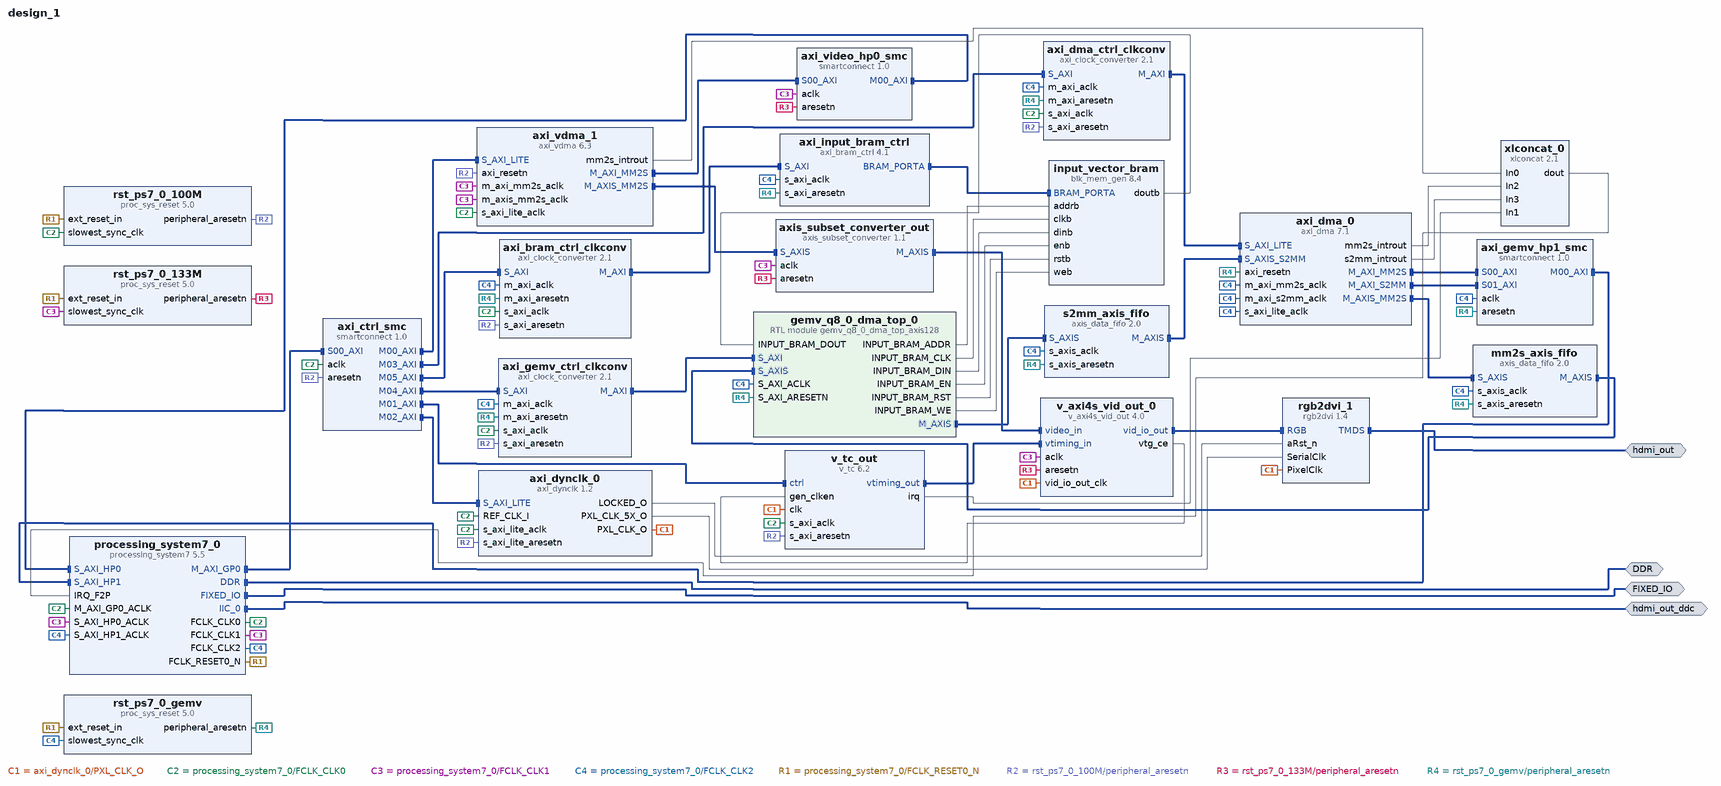
[diagram p0: block diagram of the top level]
# Vivado block design design_1, xc7z020clg400-1, Vivado 2024.2.2
create_bd_design design_1

create_bd_intf_port -mode Master -vlnv xilinx.com:interface:ddrx_rtl:1.0 DDR
create_bd_intf_port -mode Master -vlnv xilinx.com:display_processing_system7:fixedio_rtl:1.0 FIXED_IO
create_bd_intf_port -mode Master -vlnv digilentinc.com:interface:tmds_rtl:1.0 hdmi_out
create_bd_intf_port -mode Master -vlnv xilinx.com:interface:iic_rtl:1.0 hdmi_out_ddc

create_bd_cell -type ip -vlnv xilinx.com:ip:processing_system7:5.5 processing_system7_0
set_property -dict [list \
  CONFIG.PCW_APU_PERIPHERAL_FREQMHZ 666.666666 \
  CONFIG.PCW_ENET0_ENET0_IO {MIO 16 .. 27} \
  CONFIG.PCW_ENET0_GRP_MDIO_ENABLE 1 \
  CONFIG.PCW_ENET0_GRP_MDIO_IO {MIO 52 .. 53} \
  CONFIG.PCW_ENET0_PERIPHERAL_ENABLE 1 \
  CONFIG.PCW_ENET0_RESET_ENABLE 0 \
  CONFIG.PCW_ENET_RESET_ENABLE 1 \
  CONFIG.PCW_ENET_RESET_SELECT {Share reset pin} \
  CONFIG.PCW_EN_CLK1_PORT 1 \
  CONFIG.PCW_EN_CLK2_PORT 1 \
  CONFIG.PCW_FCLK_CLK1_BUF TRUE \
  CONFIG.PCW_FCLK_CLK2_BUF TRUE \
  CONFIG.PCW_FPGA0_PERIPHERAL_FREQMHZ 100.000000 \
  CONFIG.PCW_FPGA1_PERIPHERAL_FREQMHZ 133.333333 \
  CONFIG.PCW_FPGA2_PERIPHERAL_FREQMHZ 74.000000 \
  CONFIG.PCW_FPGA_FCLK1_ENABLE 1 \
  CONFIG.PCW_FPGA_FCLK2_ENABLE 1 \
  CONFIG.PCW_GPIO_MIO_GPIO_ENABLE 1 \
  CONFIG.PCW_GPIO_MIO_GPIO_IO MIO \
  CONFIG.PCW_I2C0_I2C0_IO EMIO \
  CONFIG.PCW_I2C0_PERIPHERAL_ENABLE 1 \
  CONFIG.PCW_I2C_PERIPHERAL_FREQMHZ 111.111115 \
  CONFIG.PCW_I2C_RESET_ENABLE 1 \
  CONFIG.PCW_I2C_RESET_SELECT {Share reset pin} \
  CONFIG.PCW_IRQ_F2P_INTR 1 \
  CONFIG.PCW_PRESET_BANK1_VOLTAGE {LVCMOS 1.8V} \
  CONFIG.PCW_QSPI_GRP_FBCLK_ENABLE 1 \
  CONFIG.PCW_QSPI_GRP_FBCLK_IO {MIO 8} \
  CONFIG.PCW_QSPI_GRP_SINGLE_SS_ENABLE 1 \
  CONFIG.PCW_QSPI_GRP_SINGLE_SS_IO {MIO 1 .. 6} \
  CONFIG.PCW_QSPI_PERIPHERAL_ENABLE 1 \
  CONFIG.PCW_QSPI_QSPI_IO {MIO 1 .. 6} \
  CONFIG.PCW_SD0_GRP_CD_ENABLE 1 \
  CONFIG.PCW_SD0_GRP_CD_IO {MIO 47} \
  CONFIG.PCW_SD0_GRP_WP_ENABLE 0 \
  CONFIG.PCW_SD0_PERIPHERAL_ENABLE 1 \
  CONFIG.PCW_SD0_SD0_IO {MIO 40 .. 45} \
  CONFIG.PCW_SDIO_PERIPHERAL_FREQMHZ 50 \
  CONFIG.PCW_SINGLE_QSPI_DATA_MODE x4 \
  CONFIG.PCW_UART1_PERIPHERAL_ENABLE 1 \
  CONFIG.PCW_UART1_UART1_IO {MIO 48 .. 49} \
  CONFIG.PCW_UART_PERIPHERAL_FREQMHZ 100 \
  CONFIG.PCW_UIPARAM_DDR_FREQ_MHZ 533.333333 \
  CONFIG.PCW_UIPARAM_DDR_MEMORY_TYPE {DDR 3 (Low Voltage)} \
  CONFIG.PCW_UIPARAM_DDR_PARTNO {MT41K256M16 RE-125} \
  CONFIG.PCW_USB0_PERIPHERAL_ENABLE 1 \
  CONFIG.PCW_USB0_RESET_ENABLE 1 \
  CONFIG.PCW_USB0_RESET_IO {MIO 46} \
  CONFIG.PCW_USB0_USB0_IO {MIO 28 .. 39} \
  CONFIG.PCW_USB_RESET_ENABLE 1 \
  CONFIG.PCW_USB_RESET_SELECT {Share reset pin} \
  CONFIG.PCW_USE_FABRIC_INTERRUPT 1 \
  CONFIG.PCW_USE_S_AXI_HP0 1 \
  CONFIG.PCW_USE_S_AXI_HP1 1 \
] [get_bd_cells processing_system7_0]
# 301 more settings of processing_system7_0 are not shown: defaults, MIO pin electricals, DDR timing, and values the tool derives
create_bd_cell -type ip -vlnv xilinx.com:ip:proc_sys_reset:5.0 rst_ps7_0_100M
create_bd_cell -type ip -vlnv xilinx.com:ip:proc_sys_reset:5.0 rst_ps7_0_133M
create_bd_cell -type ip -vlnv xilinx.com:ip:proc_sys_reset:5.0 rst_ps7_0_gemv
create_bd_cell -type ip -vlnv xilinx.com:ip:smartconnect:1.0 axi_ctrl_smc
set_property -dict {CONFIG.NUM_MI 6 CONFIG.NUM_SI 1} [get_bd_cells axi_ctrl_smc]
create_bd_cell -type ip -vlnv xilinx.com:ip:smartconnect:1.0 axi_video_hp0_smc
set_property -dict {CONFIG.NUM_MI 1 CONFIG.NUM_SI 1} [get_bd_cells axi_video_hp0_smc]
create_bd_cell -type ip -vlnv xilinx.com:ip:smartconnect:1.0 axi_gemv_hp1_smc
set_property -dict {CONFIG.NUM_MI 1 CONFIG.NUM_SI 2} [get_bd_cells axi_gemv_hp1_smc]
create_bd_cell -type ip -vlnv xilinx.com:ip:axi_clock_converter:2.1 axi_gemv_ctrl_clkconv
set_property -dict {CONFIG.ADDR_WIDTH 12 CONFIG.DATA_WIDTH 32 CONFIG.PROTOCOL AXI4LITE} [get_bd_cells axi_gemv_ctrl_clkconv]
create_bd_cell -type ip -vlnv xilinx.com:ip:axi_clock_converter:2.1 axi_bram_ctrl_clkconv
set_property -dict {CONFIG.ADDR_WIDTH 16 CONFIG.DATA_WIDTH 32 CONFIG.PROTOCOL AXI4} [get_bd_cells axi_bram_ctrl_clkconv]
create_bd_cell -type ip -vlnv xilinx.com:ip:axi_clock_converter:2.1 axi_dma_ctrl_clkconv
set_property -dict {CONFIG.ADDR_WIDTH 10 CONFIG.DATA_WIDTH 32 CONFIG.PROTOCOL AXI4LITE} [get_bd_cells axi_dma_ctrl_clkconv]
create_bd_cell -type ip -vlnv digilentinc.com:ip:axi_dynclk:1.2 axi_dynclk_0
create_bd_cell -type ip -vlnv xilinx.com:ip:v_tc:6.2 v_tc_out
set_property -dict {CONFIG.enable_detection false} [get_bd_cells v_tc_out]
create_bd_cell -type ip -vlnv xilinx.com:ip:axi_vdma:6.3 axi_vdma_1
set_property -dict [list \
  CONFIG.c_include_mm2s_dre 1 \
  CONFIG.c_include_s2mm 0 \
  CONFIG.c_m_axis_mm2s_tdata_width 24 \
  CONFIG.c_mm2s_linebuffer_depth 2048 \
  CONFIG.c_mm2s_max_burst_length 32 \
  CONFIG.c_num_fstores 1 \
] [get_bd_cells axi_vdma_1]
create_bd_cell -type ip -vlnv xilinx.com:ip:axis_subset_converter:1.1 axis_subset_converter_out
set_property -dict [list \
  CONFIG.M_HAS_TKEEP 1 \
  CONFIG.M_HAS_TLAST 1 \
  CONFIG.M_HAS_TREADY 1 \
  CONFIG.M_HAS_TSTRB 0 \
  CONFIG.M_TDATA_NUM_BYTES 3 \
  CONFIG.M_TDEST_WIDTH 0 \
  CONFIG.M_TID_WIDTH 0 \
  CONFIG.M_TUSER_WIDTH 1 \
  CONFIG.S_HAS_TKEEP 1 \
  CONFIG.S_HAS_TLAST 1 \
  CONFIG.S_HAS_TREADY 1 \
  CONFIG.S_HAS_TSTRB 0 \
  CONFIG.S_TDATA_NUM_BYTES 3 \
  CONFIG.S_TDEST_WIDTH 0 \
  CONFIG.S_TID_WIDTH 0 \
  CONFIG.S_TUSER_WIDTH 1 \
  CONFIG.TDATA_REMAP {tdata[23:16],tdata[7:0],tdata[15:8]} \
  CONFIG.TKEEP_REMAP {tkeep[2:0]} \
  CONFIG.TLAST_REMAP {tlast[0]} \
  CONFIG.TUSER_REMAP {tuser[0:0]} \
] [get_bd_cells axis_subset_converter_out]
create_bd_cell -type ip -vlnv xilinx.com:ip:v_axi4s_vid_out:4.0 v_axi4s_vid_out_0
set_property -dict {CONFIG.C_ADDR_WIDTH 12 CONFIG.C_HAS_ASYNC_CLK 1 CONFIG.C_VTG_MASTER_SLAVE 1} [get_bd_cells v_axi4s_vid_out_0]
create_bd_cell -type ip -vlnv digilentinc.com:ip:rgb2dvi:1.4 rgb2dvi_1
set_property -dict [list \
  CONFIG.TMDS_BOARD_INTERFACE hdmi_out \
  CONFIG.kGenerateSerialClk false \
  CONFIG.kRstActiveHigh false \
] [get_bd_cells rgb2dvi_1]
create_bd_cell -type ip -vlnv xilinx.com:ip:axi_dma:7.1 axi_dma_0
set_property -dict [list \
  CONFIG.c_include_mm2s 1 \
  CONFIG.c_include_mm2s_dre 1 \
  CONFIG.c_include_s2mm 1 \
  CONFIG.c_include_s2mm_dre 1 \
  CONFIG.c_include_sg 0 \
  CONFIG.c_m_axi_mm2s_data_width 128 \
  CONFIG.c_m_axi_s2mm_data_width 32 \
  CONFIG.c_m_axis_mm2s_tdata_width 128 \
  CONFIG.c_s_axis_s2mm_tdata_width 32 \
] [get_bd_cells axi_dma_0]
create_bd_cell -type ip -vlnv xilinx.com:ip:axis_data_fifo:2.0 mm2s_axis_fifo
set_property -dict [list \
  CONFIG.FIFO_DEPTH 1024 \
  CONFIG.HAS_TKEEP 1 \
  CONFIG.HAS_TLAST 1 \
  CONFIG.TDATA_NUM_BYTES 16 \
] [get_bd_cells mm2s_axis_fifo]
create_bd_cell -type ip -vlnv xilinx.com:ip:axis_data_fifo:2.0 s2mm_axis_fifo
set_property -dict [list \
  CONFIG.FIFO_DEPTH 1024 \
  CONFIG.HAS_TKEEP 1 \
  CONFIG.HAS_TLAST 1 \
  CONFIG.TDATA_NUM_BYTES 4 \
] [get_bd_cells s2mm_axis_fifo]
create_bd_cell -type ip -vlnv xilinx.com:ip:axi_bram_ctrl:4.1 axi_input_bram_ctrl
set_property -dict {CONFIG.DATA_WIDTH 32 CONFIG.SINGLE_PORT_BRAM 1} [get_bd_cells axi_input_bram_ctrl]
create_bd_cell -type ip -vlnv xilinx.com:ip:blk_mem_gen:8.4 input_vector_bram
set_property -dict [list \
  CONFIG.Memory_Type True_Dual_Port_RAM \
  CONFIG.Read_Width_A 32 \
  CONFIG.Read_Width_B 32 \
  CONFIG.Register_PortA_Output_of_Memory_Primitives false \
  CONFIG.Register_PortB_Output_of_Memory_Primitives false \
  CONFIG.Write_Width_A 32 \
  CONFIG.Write_Width_B 32 \
] [get_bd_cells input_vector_bram]
create_bd_cell -type ip -vlnv xilinx.com:ip:xlconcat:2.1 xlconcat_0
set_property -dict {CONFIG.NUM_PORTS 4} [get_bd_cells xlconcat_0]
create_bd_cell -type module -reference gemv_q8_0_dma_top_axis128 gemv_q8_0_dma_top_0

# ---- connections ----

connect_bd_intf_net [get_bd_intf_pins axi_bram_ctrl_clkconv/M_AXI] [get_bd_intf_pins axi_input_bram_ctrl/S_AXI]
connect_bd_intf_net [get_bd_intf_pins axi_ctrl_smc/M00_AXI] [get_bd_intf_pins axi_vdma_1/S_AXI_LITE]
connect_bd_intf_net [get_bd_intf_pins axi_ctrl_smc/M01_AXI] [get_bd_intf_pins v_tc_out/ctrl]
connect_bd_intf_net [get_bd_intf_pins axi_ctrl_smc/M02_AXI] [get_bd_intf_pins axi_dynclk_0/S_AXI_LITE]
connect_bd_intf_net [get_bd_intf_pins axi_ctrl_smc/M03_AXI] [get_bd_intf_pins axi_dma_ctrl_clkconv/S_AXI]
connect_bd_intf_net [get_bd_intf_pins axi_ctrl_smc/M04_AXI] [get_bd_intf_pins axi_gemv_ctrl_clkconv/S_AXI]
connect_bd_intf_net [get_bd_intf_pins axi_ctrl_smc/M05_AXI] [get_bd_intf_pins axi_bram_ctrl_clkconv/S_AXI]
connect_bd_intf_net [get_bd_intf_pins axi_dma_0/M_AXIS_MM2S] [get_bd_intf_pins mm2s_axis_fifo/S_AXIS]
connect_bd_intf_net [get_bd_intf_pins axi_dma_0/M_AXI_MM2S] [get_bd_intf_pins axi_gemv_hp1_smc/S00_AXI]
connect_bd_intf_net [get_bd_intf_pins axi_dma_0/M_AXI_S2MM] [get_bd_intf_pins axi_gemv_hp1_smc/S01_AXI]
connect_bd_intf_net [get_bd_intf_pins axi_dma_ctrl_clkconv/M_AXI] [get_bd_intf_pins axi_dma_0/S_AXI_LITE]
connect_bd_intf_net [get_bd_intf_pins axi_gemv_ctrl_clkconv/M_AXI] [get_bd_intf_pins gemv_q8_0_dma_top_0/S_AXI]
connect_bd_intf_net [get_bd_intf_pins axi_gemv_hp1_smc/M00_AXI] [get_bd_intf_pins processing_system7_0/S_AXI_HP1]
connect_bd_intf_net [get_bd_intf_pins axi_input_bram_ctrl/BRAM_PORTA] [get_bd_intf_pins input_vector_bram/BRAM_PORTA]
connect_bd_intf_net [get_bd_intf_pins axi_vdma_1/M_AXIS_MM2S] [get_bd_intf_pins axis_subset_converter_out/S_AXIS]
connect_bd_intf_net [get_bd_intf_pins axi_vdma_1/M_AXI_MM2S] [get_bd_intf_pins axi_video_hp0_smc/S00_AXI]
connect_bd_intf_net [get_bd_intf_pins axi_video_hp0_smc/M00_AXI] [get_bd_intf_pins processing_system7_0/S_AXI_HP0]
connect_bd_intf_net [get_bd_intf_pins axis_subset_converter_out/M_AXIS] [get_bd_intf_pins v_axi4s_vid_out_0/video_in]
connect_bd_intf_net [get_bd_intf_pins gemv_q8_0_dma_top_0/M_AXIS] [get_bd_intf_pins s2mm_axis_fifo/S_AXIS]
connect_bd_intf_net [get_bd_intf_pins mm2s_axis_fifo/M_AXIS] [get_bd_intf_pins gemv_q8_0_dma_top_0/S_AXIS]
connect_bd_intf_net [get_bd_intf_ports DDR] [get_bd_intf_pins processing_system7_0/DDR]
connect_bd_intf_net [get_bd_intf_ports FIXED_IO] [get_bd_intf_pins processing_system7_0/FIXED_IO]
connect_bd_intf_net [get_bd_intf_pins processing_system7_0/IIC_0] [get_bd_intf_ports hdmi_out_ddc]
connect_bd_intf_net [get_bd_intf_pins processing_system7_0/M_AXI_GP0] [get_bd_intf_pins axi_ctrl_smc/S00_AXI]
connect_bd_intf_net [get_bd_intf_pins rgb2dvi_1/TMDS] [get_bd_intf_ports hdmi_out]
connect_bd_intf_net [get_bd_intf_pins s2mm_axis_fifo/M_AXIS] [get_bd_intf_pins axi_dma_0/S_AXIS_S2MM]
connect_bd_intf_net [get_bd_intf_pins v_axi4s_vid_out_0/vid_io_out] [get_bd_intf_pins rgb2dvi_1/RGB]
connect_bd_intf_net [get_bd_intf_pins v_axi4s_vid_out_0/vtiming_in] [get_bd_intf_pins v_tc_out/vtiming_out]
connect_bd_net [get_bd_pins axi_dma_0/mm2s_introut] [get_bd_pins xlconcat_0/In2]
connect_bd_net [get_bd_pins axi_dma_0/s2mm_introut] [get_bd_pins xlconcat_0/In3]
connect_bd_net [get_bd_pins axi_dynclk_0/LOCKED_O] [get_bd_pins rgb2dvi_1/aRst_n]
connect_bd_net [get_bd_pins axi_dynclk_0/PXL_CLK_5X_O] [get_bd_pins rgb2dvi_1/SerialClk]
connect_bd_net [get_bd_pins axi_dynclk_0/PXL_CLK_O] \
  [get_bd_pins rgb2dvi_1/PixelClk] [get_bd_pins v_axi4s_vid_out_0/vid_io_out_clk] [get_bd_pins v_tc_out/clk]
connect_bd_net [get_bd_pins axi_vdma_1/mm2s_introut] [get_bd_pins xlconcat_0/In0]
connect_bd_net [get_bd_pins gemv_q8_0_dma_top_0/INPUT_BRAM_ADDR] [get_bd_pins input_vector_bram/addrb]
connect_bd_net [get_bd_pins gemv_q8_0_dma_top_0/INPUT_BRAM_CLK] [get_bd_pins input_vector_bram/clkb]
connect_bd_net [get_bd_pins gemv_q8_0_dma_top_0/INPUT_BRAM_DIN] [get_bd_pins input_vector_bram/dinb]
connect_bd_net [get_bd_pins gemv_q8_0_dma_top_0/INPUT_BRAM_EN] [get_bd_pins input_vector_bram/enb]
connect_bd_net [get_bd_pins gemv_q8_0_dma_top_0/INPUT_BRAM_RST] [get_bd_pins input_vector_bram/rstb]
connect_bd_net [get_bd_pins gemv_q8_0_dma_top_0/INPUT_BRAM_WE] [get_bd_pins input_vector_bram/web]
connect_bd_net [get_bd_pins input_vector_bram/doutb] [get_bd_pins gemv_q8_0_dma_top_0/INPUT_BRAM_DOUT]
connect_bd_net [get_bd_pins processing_system7_0/FCLK_CLK0] \
  [get_bd_pins rst_ps7_0_100M/slowest_sync_clk] [get_bd_pins processing_system7_0/M_AXI_GP0_ACLK] \
  [get_bd_pins axi_ctrl_smc/aclk] [get_bd_pins axi_dynclk_0/REF_CLK_I] [get_bd_pins axi_dynclk_0/s_axi_lite_aclk] \
  [get_bd_pins v_tc_out/s_axi_aclk] [get_bd_pins axi_vdma_1/s_axi_lite_aclk] [get_bd_pins axi_dma_ctrl_clkconv/s_axi_aclk] \
  [get_bd_pins axi_gemv_ctrl_clkconv/s_axi_aclk] [get_bd_pins axi_bram_ctrl_clkconv/s_axi_aclk]
connect_bd_net [get_bd_pins processing_system7_0/FCLK_CLK1] \
  [get_bd_pins rst_ps7_0_133M/slowest_sync_clk] [get_bd_pins processing_system7_0/S_AXI_HP0_ACLK] \
  [get_bd_pins axi_video_hp0_smc/aclk] [get_bd_pins axi_vdma_1/m_axi_mm2s_aclk] [get_bd_pins axi_vdma_1/m_axis_mm2s_aclk] \
  [get_bd_pins axis_subset_converter_out/aclk] [get_bd_pins v_axi4s_vid_out_0/aclk]
connect_bd_net [get_bd_pins processing_system7_0/FCLK_CLK2] \
  [get_bd_pins rst_ps7_0_gemv/slowest_sync_clk] [get_bd_pins processing_system7_0/S_AXI_HP1_ACLK] \
  [get_bd_pins axi_gemv_hp1_smc/aclk] [get_bd_pins axi_dma_0/m_axi_mm2s_aclk] [get_bd_pins axi_dma_0/m_axi_s2mm_aclk] \
  [get_bd_pins axi_dma_0/s_axi_lite_aclk] [get_bd_pins mm2s_axis_fifo/s_axis_aclk] [get_bd_pins s2mm_axis_fifo/s_axis_aclk] \
  [get_bd_pins axi_input_bram_ctrl/s_axi_aclk] [get_bd_pins axi_dma_ctrl_clkconv/m_axi_aclk] \
  [get_bd_pins axi_gemv_ctrl_clkconv/m_axi_aclk] [get_bd_pins axi_bram_ctrl_clkconv/m_axi_aclk] \
  [get_bd_pins gemv_q8_0_dma_top_0/S_AXI_ACLK]
connect_bd_net [get_bd_pins processing_system7_0/FCLK_RESET0_N] \
  [get_bd_pins rst_ps7_0_100M/ext_reset_in] [get_bd_pins rst_ps7_0_133M/ext_reset_in] \
  [get_bd_pins rst_ps7_0_gemv/ext_reset_in]
connect_bd_net [get_bd_pins rst_ps7_0_100M/peripheral_aresetn] \
  [get_bd_pins axi_ctrl_smc/aresetn] [get_bd_pins axi_dynclk_0/s_axi_lite_aresetn] [get_bd_pins v_tc_out/s_axi_aresetn] \
  [get_bd_pins axi_vdma_1/axi_resetn] [get_bd_pins axi_dma_ctrl_clkconv/s_axi_aresetn] \
  [get_bd_pins axi_gemv_ctrl_clkconv/s_axi_aresetn] [get_bd_pins axi_bram_ctrl_clkconv/s_axi_aresetn]
connect_bd_net [get_bd_pins rst_ps7_0_133M/peripheral_aresetn] \
  [get_bd_pins axi_video_hp0_smc/aresetn] [get_bd_pins axis_subset_converter_out/aresetn] \
  [get_bd_pins v_axi4s_vid_out_0/aresetn]
connect_bd_net [get_bd_pins rst_ps7_0_gemv/peripheral_aresetn] \
  [get_bd_pins axi_gemv_hp1_smc/aresetn] [get_bd_pins axi_dma_0/axi_resetn] [get_bd_pins mm2s_axis_fifo/s_axis_aresetn] \
  [get_bd_pins s2mm_axis_fifo/s_axis_aresetn] [get_bd_pins axi_input_bram_ctrl/s_axi_aresetn] \
  [get_bd_pins axi_dma_ctrl_clkconv/m_axi_aresetn] [get_bd_pins axi_gemv_ctrl_clkconv/m_axi_aresetn] \
  [get_bd_pins axi_bram_ctrl_clkconv/m_axi_aresetn] [get_bd_pins gemv_q8_0_dma_top_0/S_AXI_ARESETN]
connect_bd_net [get_bd_pins v_axi4s_vid_out_0/vtg_ce] [get_bd_pins v_tc_out/gen_clken]
connect_bd_net [get_bd_pins v_tc_out/irq] [get_bd_pins xlconcat_0/In1]
connect_bd_net [get_bd_pins xlconcat_0/dout] [get_bd_pins processing_system7_0/IRQ_F2P]
set_property HDL_ATTRIBUTE.BMM_INFO_PROCESSOR {arm > design_1 axi_input_bram_ctrl} [get_bd_cells processing_system7_0]
set_property HDL_ATTRIBUTE.KEEP_HIERARCHY yes [get_bd_cells processing_system7_0]
set_property HDL_ATTRIBUTE.BMM_INFO_ADDRESS_SPACE {byte  0x42000000 32 > design_1 input_vector_bram} [get_bd_cells axi_input_bram_ctrl]
set_property HDL_ATTRIBUTE.KEEP_HIERARCHY yes [get_bd_cells axi_input_bram_ctrl]

# ---- address map ----
assign_bd_address -offset 0x00000000 -range 1G -target_address_space [get_bd_addr_spaces axi_dma_0/Data_MM2S] [get_bd_addr_segs processing_system7_0/S_AXI_HP1/HP1_DDR_LOWOCM]
assign_bd_address -offset 0x00000000 -range 1G -target_address_space [get_bd_addr_spaces axi_dma_0/Data_S2MM] [get_bd_addr_segs processing_system7_0/S_AXI_HP1/HP1_DDR_LOWOCM]
assign_bd_address -offset 0x00000000 -range 1G -target_address_space [get_bd_addr_spaces axi_vdma_1/Data_MM2S] [get_bd_addr_segs processing_system7_0/S_AXI_HP0/HP0_DDR_LOWOCM]
assign_bd_address -offset 0x40400000 -range 64K -target_address_space [get_bd_addr_spaces processing_system7_0/Data] [get_bd_addr_segs axi_dma_0/S_AXI_LITE/Reg]
assign_bd_address -offset 0x42000000 -range 64K -target_address_space [get_bd_addr_spaces processing_system7_0/Data] [get_bd_addr_segs axi_input_bram_ctrl/S_AXI/Mem0]
assign_bd_address -offset 0x43C10000 -range 64K -target_address_space [get_bd_addr_spaces processing_system7_0/Data] [get_bd_addr_segs v_tc_out/ctrl/Reg]
assign_bd_address -offset 0x43C20000 -range 64K -target_address_space [get_bd_addr_spaces processing_system7_0/Data] [get_bd_addr_segs axi_dynclk_0/S_AXI_LITE/S_AXI_LITE_reg]
assign_bd_address -offset 0x43CA0000 -range 4K -target_address_space [get_bd_addr_spaces processing_system7_0/Data] [get_bd_addr_segs gemv_q8_0_dma_top_0/S_AXI/reg0]

validate_bd_design
save_bd_design
